# EAGLE design terminal board (EAGLE 5.06)
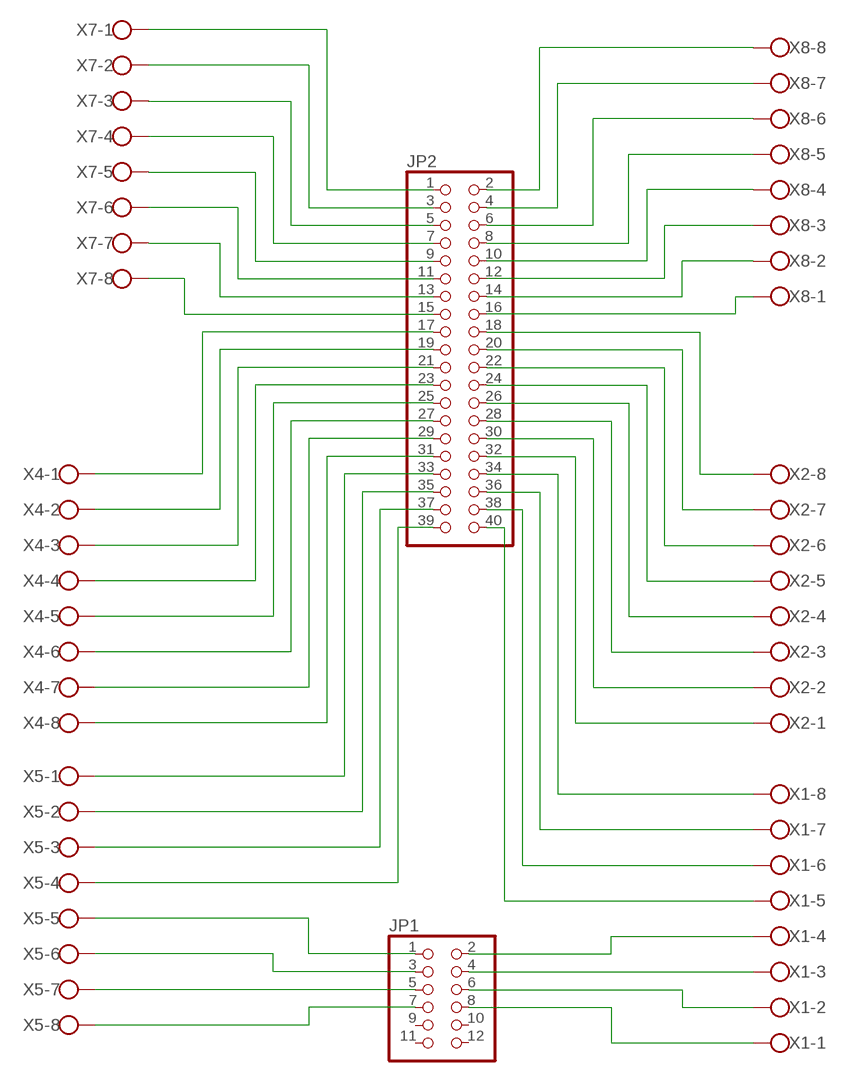
[diagram p0: schematic, sheet 1]

## Parts
JP1  PINHD-2X6  [2X06]
JP2  PINHD-2X20  [2X20]
X1  AK550/8  [AK550/8]
X2  AK550/8  [AK550/8]
X4  AK550/8  [AK550/8]
X5  AK550/8  [AK550/8]
X7  AK550/8  [AK550/8]
X8  AK550/8  [AK550/8]

## Nets
N$1: JP2.1 X7.1
N$2: JP2.3 X7.2
N$3: JP2.5 X7.3
N$4: JP2.7 X7.4
N$5: JP2.9 X7.5
N$6: JP2.11 X7.6
N$7: JP2.13 X7.7
N$8: JP2.15 X7.8
N$9: JP2.2 X8.8
N$10: JP2.4 X8.7
N$11: JP2.6 X8.6
N$12: JP2.8 X8.5
N$13: JP2.17 X4.1
N$14: JP2.19 X4.2
N$15: JP2.10 X8.4
N$16: JP2.12 X8.3
N$17: JP2.14 X8.2
N$18: JP2.16 X8.1
N$19: JP2.21 X4.3
N$20: JP2.23 X4.4
N$21: JP2.25 X4.5
N$22: JP2.27 X4.6
N$23: JP2.29 X4.7
N$24: JP2.31 X4.8
N$25: JP2.33 X5.1
N$26: JP2.35 X5.2
N$27: JP2.37 X5.3
N$28: JP2.39 X5.4
N$29: JP2.18 X2.8
N$30: JP2.20 X2.7
N$31: JP2.22 X2.6
N$32: JP2.24 X2.5
N$33: JP2.26 X2.4
N$34: JP2.28 X2.3
N$35: JP2.30 X2.2
N$36: JP2.32 X2.1
N$37: JP2.34 X1.8
N$38: JP2.36 X1.7
N$39: JP2.38 X1.6
N$40: JP2.40 X1.5
N$41: JP1.2 X1.4
N$42: JP1.4 X1.3
N$43: JP1.6 X1.2
N$44: JP1.8 X1.1
N$45: JP1.1 X5.5
N$46: JP1.3 X5.6
N$47: JP1.5 X5.7
N$48: JP1.7 X5.8
Unconnected: JP1.9 JP1.10 JP1.11 JP1.12

## Library data of the parts
JP1 = pinhead:PINHD-2X6: PIN HEADER
JP2 = pinhead:PINHD-2X20: PIN HEADER
X1 X2 X4 X5 X7 X8 = con-ptr500+:AK550/8: CONNECTOR

## Board
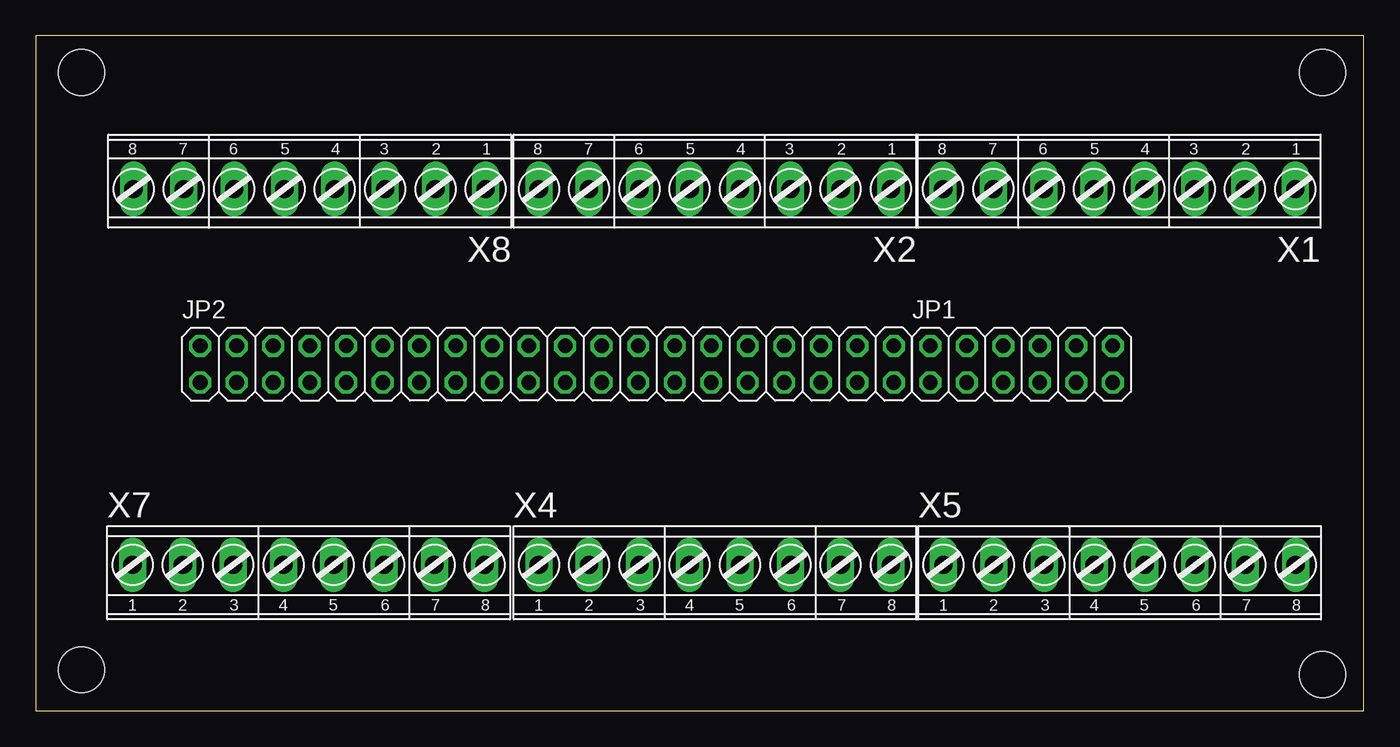
[diagram p1: board, top side]
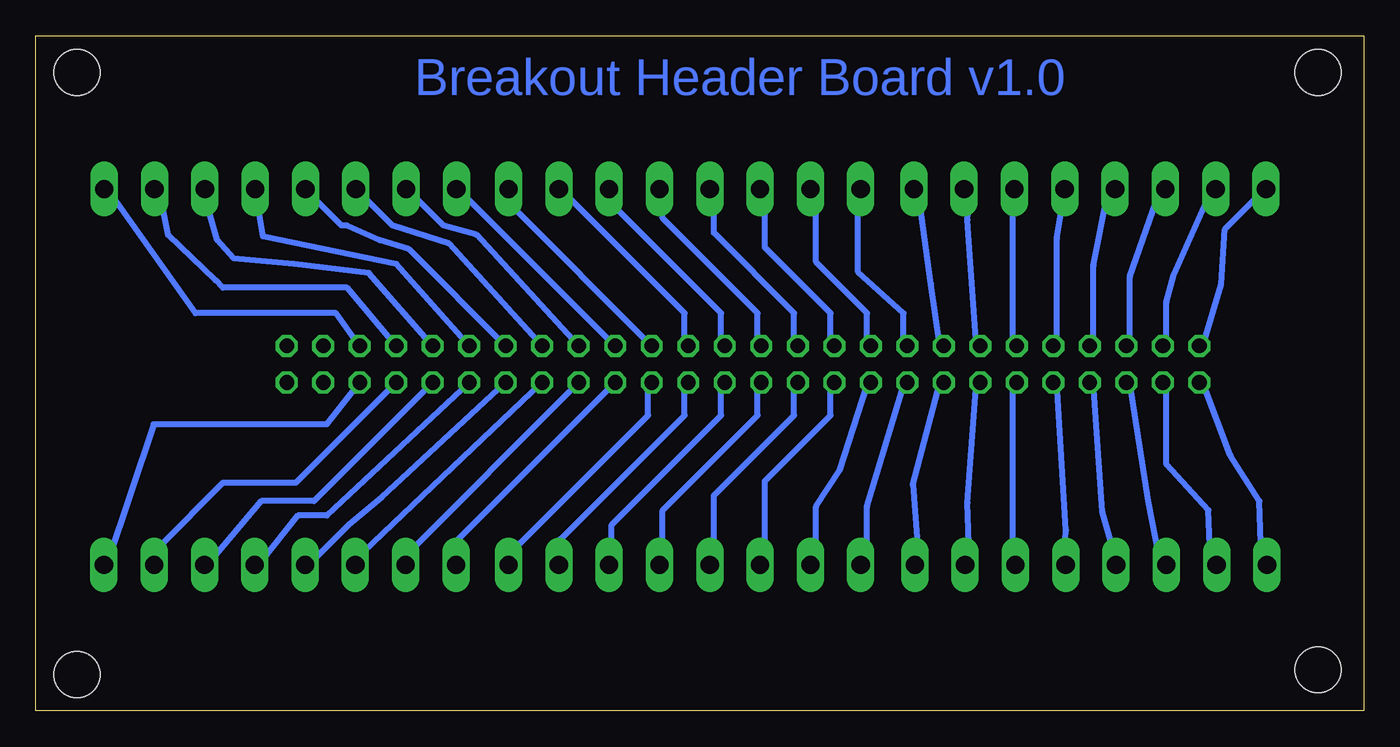
[diagram p2: board, bottom side, seen from below]

Size 92.38 x 46.98 mm. Coordinates in mm from the lower left corner, seen from the top.
Outline: 0,0 92.38,0 92.38,46.98 0,46.98 0,0
Copper layers (1*16): Top 0.035mm / dielectric 1.5mm / Bottom 0.035mm
Design rules "dave_big": minimum track width 16mil, minimum drill 24mil, track to track 14mil, track to pad 14mil, pad to pad 14mil, via to via 14mil, smd to smd 8mil, copper to edge 40mil, drill to drill 8mil, minimum pad ring 10mil, minimum via ring 8mil, stop-mask expansion 4mil, vias tented up to drill 0mil, thermal gap 10mil
Holes 3.2 mm at 3.17,2.86 3.17,44.45 89.53,44.45 89.53,2.54

### Footprints (pad centres in the part's own frame; a part is rotated, then mirrored left to right if it is on the bottom)
2X06 = drill 1.016 octagon: 1 -6.35,-1.27; 2 -6.35,1.27; 3 -3.81,-1.27; 4 -3.81,1.27; 5 -1.27,-1.27; 6 -1.27,1.27; 7 1.27,-1.27; 8 1.27,1.27; 9 3.81,-1.27; 10 3.81,1.27; 11 6.35,-1.27; 12 6.35,1.27
2X20 = drill 1.016 octagon: 1 -24.13,-1.27; 2 -24.13,1.27; 3 -21.59,-1.27; 4 -21.59,1.27; 5 -19.05,-1.27; 6 -19.05,1.27; 7 -16.51,-1.27; 8 -16.51,1.27; 9 -13.97,-1.27; 10 -13.97,1.27; 11 -11.43,-1.27; 12 -11.43,1.27; 13 -8.89,-1.27; 14 -8.89,1.27; 15 -6.35,-1.27; 16 -6.35,1.27; 17 -3.81,-1.27; 18 -3.81,1.27; 19 -1.27,-1.27; 20 -1.27,1.27; 21 1.27,-1.27; 22 1.27,1.27; 23 3.81,-1.27; 24 3.81,1.27; 25 6.35,-1.27; 26 6.35,1.27; 27 8.89,-1.27; 28 8.89,1.27; 29 11.43,-1.27; 30 11.43,1.27; 31 13.97,-1.27; 32 13.97,1.27; 33 16.51,-1.27; 34 16.51,1.27; 35 19.05,-1.27; 36 19.05,1.27; 37 21.59,-1.27; 38 21.59,1.27; 39 24.13,-1.27; 40 24.13,1.27
AK550/8 = drill 1.27 long: 1 -12.25,0; 2 -8.75,0; 3 -5.25,0; 4 -1.75,0; 5 1.75,0; 6 5.25,0; 7 8.75,0; 8 12.25,0

### Placement (x,y rotation side)
JP1  68.58,24.13 0 top
JP2  35.56,24.13 0 top
X1  75.37,36.32 180 top
X2  47.24,36.32 180 top
X4  47.24,10.16 0 top
X5  75.4,10.16 0 top
X7  18.97,10.17 0 top
X8  19.04,36.32 180 top

### Tracks (layer width: path | path; a pad name or v marks a point on that pad's centre or on a via)
N$1
  Bottom 0.406: JP2.1 11.18,22.86 9.27,17.78 7.24,14.61 7.11,10.67 X7.1
N$2
  Bottom 0.406: JP2.3 13.72,22.86 13.72,17.14 10.8,13.97 10.67,10.67 X7.2
N$3
  Bottom 0.406: JP2.5 16.26,22.86 14.99,14.61 14.22,10.67 X7.3
N$4
  Bottom 0.406: JP2.7 18.8,22.86 18.16,13.84 17.27,10.67 X7.4
N$5
  Bottom 0.406: JP2.9 21.34,22.86 20.7,12.57 20.83,10.67 X7.5
N$6
  Bottom 0.406: JP2.11 24.38,22.86 24.38,10.67 X7.6
N$7
  Bottom 0.406: JP2.13 26.92,22.86 27.56,14.48 27.43,10.67 X7.7
N$8
  Bottom 0.406: JP2.15 29.46,22.86 31.37,15.75 30.99,10.67 X7.8
N$9
  Bottom 0.406: JP2.2 11.18,25.4 9.91,29.72 9.65,33.53 7.11,36.07 X8.8
N$10
  Bottom 0.406: JP2.4 13.72,25.4 13.72,28.45 13.21,30.35 10.67,36.07 X8.7
N$11
  Bottom 0.406: JP2.6 16.26,25.4 16.26,30.23 14.22,36.07 X8.6
N$12
  Bottom 0.406: JP2.8 18.8,25.4 18.8,30.99 17.78,36.07 X8.5
N$13
  Bottom 0.406: JP2.17 32,22.61 34.54,14.22 34.54,10.41 X4.1
N$14
  Bottom 0.406: JP2.19 34.54,22.61 36.45,16.76 38.1,14.22 38.1,10.41 X4.2
N$15
  Bottom 0.406: JP2.10 21.34,25.4 21.34,32.89 20.83,36.07 X8.4
N$16
  Bottom 0.406: JP2.12 24.38,25.4 24.38,36.07 X8.3
N$17
  Bottom 0.406: JP2.14 26.92,25.4 27.56,34.16 27.43,36.07 X8.2
N$18
  Bottom 0.406: JP2.16 29.46,25.4 30.1,29.72 30.99,36.07 X8.1
N$19
  Bottom 0.406: JP2.21 37.08,22.61 37.08,20.57 41.66,16 41.66,10.41 X4.3
N$20
  Bottom 0.406: JP2.23 39.62,22.61 39.62,20.57 45.21,14.99 45.21,10.41 X4.4
N$21
  Bottom 0.406: JP2.25 42.16,22.61 42.16,20.57 48.77,13.97 48.77,10.41 X4.5
N$22
  Bottom 0.406: JP2.27 44.7,22.61 44.7,20.57 52.32,12.95 52.32,10.41 X4.6
N$23
  Bottom 0.406: JP2.29 47.24,22.61 47.24,20.57 55.88,11.94 55.88,10.41 X4.7
N$24
  Bottom 0.406: JP2.31 49.78,22.61 49.78,20.57 59.94,10.41 X4.8
N$25
  Bottom 0.406: JP2.33 62.99,11.94 62.99,10.41 X5.1
N$26
  Bottom 0.406: JP2.35 67.06,10.41 X5.2
N$27
  Bottom 0.406: JP2.37 69.6,11.05 70.1,10.41 X5.3
N$28
  Bottom 0.406: JP2.39 68.33,14.86 70.61,12.95 73.15,10.41 X5.4
N$29
  Bottom 0.406: JP2.18 32,25.65 32,27.69 35.18,30.54 35.18,35.37 X2.8
N$30
  Bottom 0.406: JP2.20 34.54,25.65 34.54,27.69 38.1,31.24 38.1,36.32 X2.7
N$31
  Bottom 0.406: JP2.22 37.08,25.65 37.08,27.69 41.66,32.26 41.66,36.32 X2.6
N$32
  Bottom 0.406: JP2.24 39.62,25.65 39.62,27.69 45.21,33.27 45.21,36.32 X2.5
N$33
  Bottom 0.406: JP2.26 42.16,25.65 42.16,27.69 48.77,34.29 48.77,36.32 X2.4
N$34
  Bottom 0.406: JP2.28 44.7,25.65 44.7,27.69 52.32,35.31 52.32,36.32 X2.3
N$35
  Bottom 0.406: JP2.30 47.24,25.65 47.24,27.69 55.88,36.32 X2.2
N$36
  Bottom 0.406: JP2.32 59.44,35.31 59.44,36.32 X2.1
N$37
  Bottom 0.406: JP2.34 62.99,36.32 X1.8
N$38
  Bottom 0.406: JP2.36 61.72,33.15 64.01,33.78 66.55,36.32 X1.7
N$39
  Bottom 0.406: JP2.38 63.63,32.51 67.56,33.78 70.1,36.32 X1.6
N$40
  Bottom 0.406: JP2.40 66.42,32.13 68.45,32.77 70.74,33.78 71.12,33.78 73.66,36.32 X1.5
N$41
  Bottom 0.406: JP1.2 67.31,31.11 76.58,33.02 76.96,35.31 77.72,35.94 76.83,35.05 77.22,35.05 77.22,36.32 X1.4
N$42
  Bottom 0.406: JP1.4 69.21,30.48 74.42,31.11 78.61,31.5 79.76,32.77 80.77,36.32 X1.3
N$43
  Bottom 0.406: JP1.6 70.74,29.46 79.38,29.46 79.88,29.97 83.18,33.15 83.82,36.32 X1.2
N$44
  Bottom 0.406: JP1.8 71.5,27.69 81.28,27.69 87.38,36.32 X1.1
N$45
  Bottom 0.406: JP1.1 72.14,13.59 74.17,13.59 76.71,10.41 X5.5
N$46
  Bottom 0.406: JP1.3 73.02,14.61 76.71,14.61 80.26,10.41 X5.6
N$47
  Bottom 0.406: JP1.5 74.29,15.88 79.38,15.88 83.82,11.43 83.82,10.49 X5.7
N$48
  Bottom 0.406: JP1.7 72.14,19.94 84.2,19.94 87.38,10.41 X5.8

### Text on the board
Bottom: Breakout Header Board v1.0